# EAGLE schematic CC2533_PCB_Main (EAGLE 6.4)
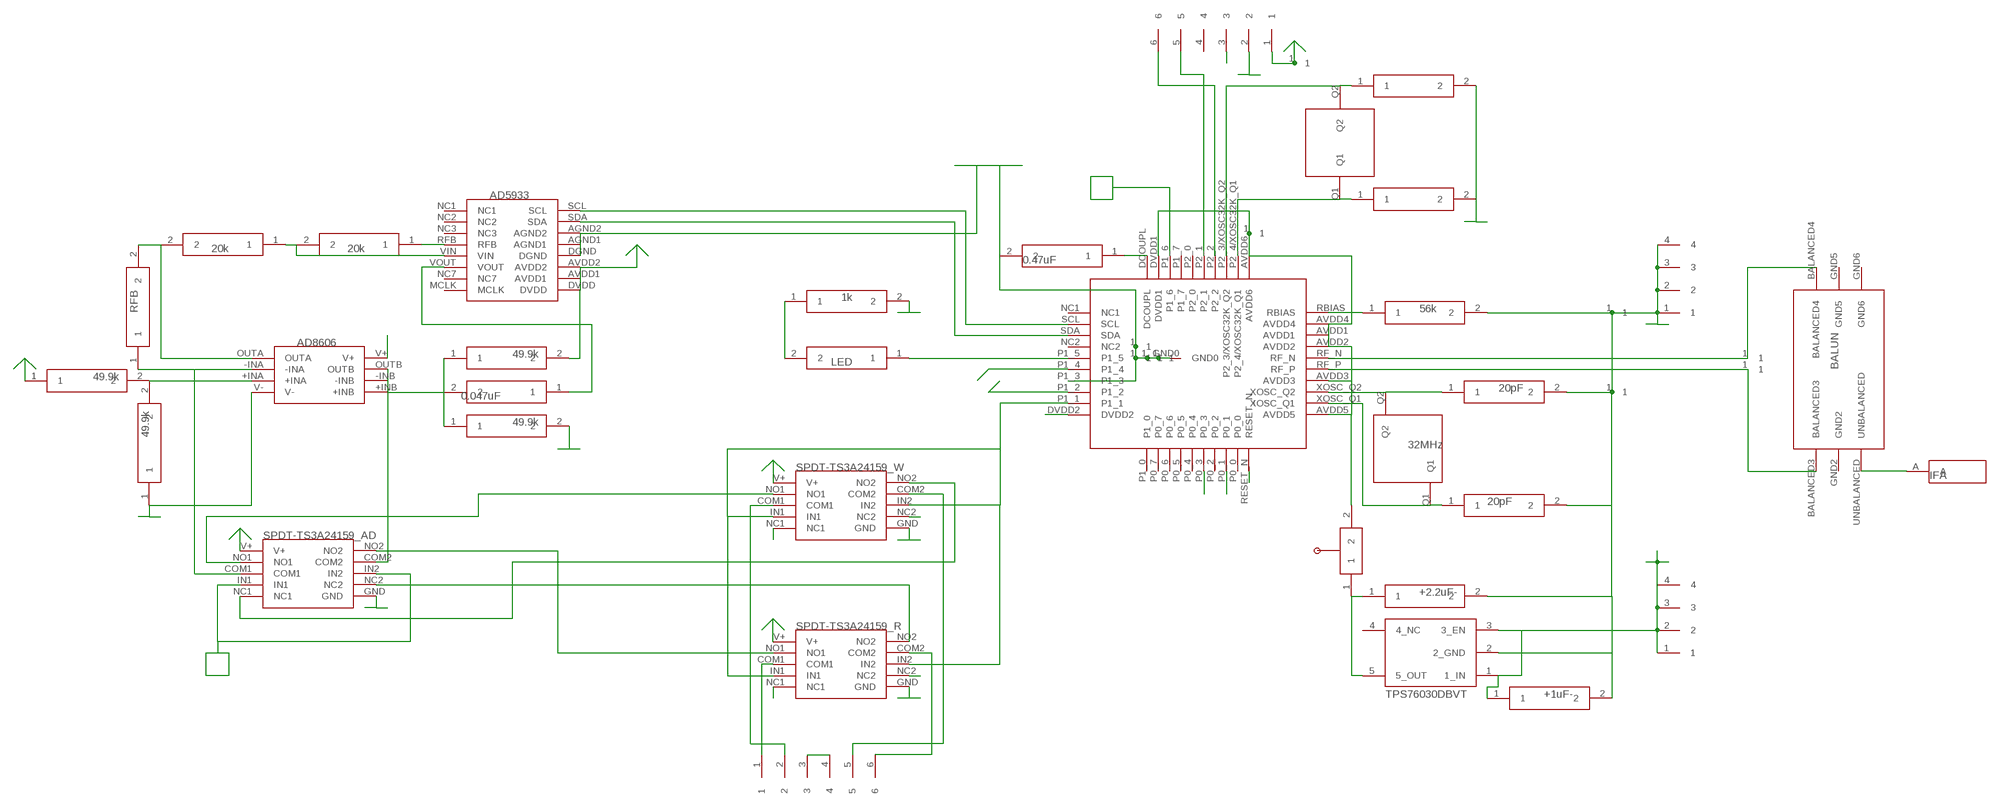
[diagram p0: schematic, sheet 1]

## Parts
U$1  CC2533  [CC2533]
U$2  BALUN  [BALUN]
U$3  X32MHZ  [X32MHZ]
U$4  0201  [0201]
U$5  0201  [0201]
U$6  ANTENNA_BOTTOM  [ANTENNA_BOTTOM]
U$7  FFC4POS  [FFC4POS]
U$8  FFC4POS  [FFC4POS]
U$9  56k  0201  [0201]
U$10  REGULATOR  [REGULATOR]
U$11  0603  [0603]
U$12  0603  [0603]
U$13  SPDT_DUAL  [SPDT_DUAL]
U$14  0201  [0201]
U$15  SPDT_DUAL  [SPDT_DUAL]
U$16  AD5933  [AD5933]
U$17  FFC6POS  [FFC6POS]
U$18  SWITCH_MANUAL  [SWITCH_MANUAL]
U$19  SPDT_DUAL  [SPDT_DUAL]
U$20  AD8606_OPAMP  [AD8606_OPAMP]
U$21  0603_RES  [0603_RES]
U$22  0603_RES  [0603_RES]
U$23  0603_RES  [0603_RES]
U$24  0201  [0201]
U$25  0201  [0201]
U$26  0402_CAP  [0402_CAP]
U$27  0201  [0201]
U$28  0201  [0201]
U$29  0603_RES  [0603_RES]
U$30  FFC6POS  [FFC6POS]
U$31  0402  [0402]
U$32  DRILL_HOLE  [DRILL_HOLE]
U$33  DRILL_HOLE  [DRILL_HOLE]
U$36  DRILL_HOLE  [DRILL_HOLE]
U$39  X32.768KHZ  [X32.768KHZ]
U$40  0201  [0201]
U$41  0201  [0201]
U$42  DRILL_HOLE  [DRILL_HOLE]
U$43  DRILL_HOLE  [DRILL_HOLE]
U$44  DRILL_HOLE  [DRILL_HOLE]
U$45  DRILL_HOLE  [DRILL_HOLE]
U$46  DRILL_HOLE  [DRILL_HOLE]
U$47  DRILL_HOLE  [DRILL_HOLE]
U$48  DRILL_HOLE  [DRILL_HOLE]

## Nets
GND: U$1.GND0 U$1.P1_3 U$4.2 U$5.2 U$8.1 U$8.2 U$8.3 U$8.4 U$9.2 U$10.2(2_GND) U$11.2 U$12.2 U$13.GND U$14.2 U$15.GND U$16.AGND1 U$16.AGND2 U$16.DGND U$17.2 U$19.GND U$20.V- U$25.1 U$28.2 U$30.3 U$30.4 U$31.2 U$40.2 U$41.2 U$42.1 U$43.1 U$44.1 U$45.1 U$46.1 U$47.1
IN1: U$1.P1_1 U$13.IN1 U$13.IN2 U$15.IN1 U$15.IN2
IN2: U$1.P1_6 U$19.IN1 U$19.IN2
LEFT: U$1.P1_4 U$15.NC1
N$1: U$1.RF_N U$2.BALANCED4 U$32.1
N$2: U$1.RF_P U$2.BALANCED3 U$33.1
N$3: U$2.UNBALANCED U$6.A
N$4: U$1.XOSC_Q2 U$3.Q2 U$5.1
N$5: U$1.XOSC_Q1 U$3.Q1 U$4.1
N$6: U$16.RFB U$21.1
N$7: U$15.NO1 U$19.NO1
N$8: U$15.NO2 U$19.NC1
N$9: U$13.COM1 U$30.1
N$10: U$13.COM2 U$30.6
N$11: U$19.COM1 U$20.-INA U$23.1
N$12: U$1.RBIAS U$9.1
N$13: U$1.SCL U$16.SCL
N$14: U$1.SDA U$16.SDA
N$15: U$15.COM1 U$30.2
N$16: U$1.P2_4/XOSC32K_Q1 U$39.Q1 U$41.1
N$17: U$1.P2_1 U$17.5
N$18: U$1.DCOUPL U$14.1
N$19: U$16.VOUT U$26.1
N$20: U$1.P2_2 U$17.6
N$21: U$10.5(5_OUT) U$11.1 U$18.1
N$22: U$1.P2_3/XOSC32K_Q2 U$39.Q2 U$40.1
N$23: U$16.VIN U$21.2 U$22.1
N$24: U$1.P1_5 U$29.1
N$25: U$20.OUTA U$22.2 U$23.2
N$27: U$20.+INA U$24.2 U$25.2
N$28: U$20.+INB U$26.2 U$27.1 U$28.1
N$29: U$19.COM2 U$20.-INB U$20.OUTB
N$30: U$15.COM2 U$30.5
N$31: U$13.NO1 U$19.NO2
N$32: U$13.NO2 U$19.NC2
N$34: U$29.2 U$31.1
P0_1: U$1.P0_1 U$13.NC1
P0_3: U$1.P0_3 U$13.NC2
RESET: U$1.RESET_N U$17.3
RIGHT: U$1.P1_2 U$15.NC2
V+: U$7.1 U$7.2 U$7.3 U$7.4 U$10.1(1_IN) U$10.3(3_EN) U$12.1
VDD: U$1.AVDD1 U$1.AVDD2 U$1.AVDD3 U$1.AVDD4 U$1.AVDD5 U$1.AVDD6 U$1.DVDD1 U$1.DVDD2 U$13.V+ U$15.V+ U$16.AVDD1 U$16.AVDD2 U$16.DVDD U$17.1 U$18.2 U$19.V+ U$20.V+ U$24.1 U$27.2 U$36.1 U$48.1
Unconnected: U$1.P0_0 U$1.P0_2 U$1.P0_4 U$1.P0_5 U$1.P0_6 U$1.P0_7 U$1.P1_0 U$1.P1_7 U$1.P2_0 U$10.4(4_NC) U$16.MCLK U$16.NC1 U$16.NC2 U$16.NC3 U$16.NC7 U$17.4

## Power pins joined to a net without a drawn wire
GND2: U$2.GND2
GND5: U$2.GND5
GND6: U$2.GND6
NC1: U$1.NC1
NC2: U$1.NC2

## Library data of the parts
U$1 = CC2530_PCB_TL:CC2533
U$2 = CC2530_PCB_TL:BALUN: 2.45 GHz Impedance Matched Balun-BPF: For TI CC253X, CC254X, CC257X, CC853X and CC852X Chipset family P/N 2450BM15A0002
U$3 = CC2530_PCB_TL:X32MHZ: X32MHz ABM12-32.000MHZ-B2X-T3; X: 32MHz
U$4 U$5 = CC2530_PCB_TL:0201: Package / Case 0201 (0603 Metric); CAP: 20pF
U$6 = CC2530_PCB_TL:ANTENNA_BOTTOM: Antenna for use in bottom layer of CC2530 PCB
U$7 U$8 = CC2530_PCB_TL:FFC4POS: FFC COnnector 4POS
U$9 = CC2530_PCB_TL:0201: Package / Case 0201 (0603 Metric); R_BIAS: 56k
U$10 = CC2530_PCB_TL:REGULATOR: IC REG LDO 3V 50MA SOT23-5 TPS76030DBVT
U$11 = CC2530_PCB_TL:0603: Package / Case 0603 (1608 Metric); CAP: +2.2uF-
U$12 = CC2530_PCB_TL:0603: Package / Case 0603 (1608 Metric); CAP: +1uF-
U$13 U$15 U$19 = CC2530_PCB_TL:SPDT_DUAL: TS3A24159DGSR IC SWITCH DUAL SPDT 10MSOP
U$14 = CC2530_PCB_TL:0201: Package / Case 0201 (0603 Metric); CAP: 0.47uF
U$16 = CC2530_PCB_TL:AD5933: AD5933
U$17 U$30 = CC2530_PCB_TL:FFC6POS: FFC Connector 6POS
U$18 = CC2530_PCB_TL:SWITCH_MANUAL
U$20 = CC2530_PCB_TL:AD8606_OPAMP: OPAMP AD8606ARMZ-REEL
U$21 U$22 = CC2530_PCB_TL:0603_RES; RES: 20k
U$23 U$29 = CC2530_PCB_TL:0603_RES
U$24 U$25 U$27 U$28 = CC2530_PCB_TL:0201: Package / Case 0201 (0603 Metric); RES: 49.9k
U$26 = CC2530_PCB_TL:0402_CAP; CAP: 0.047uF
U$31 = CC2530_PCB_TL:0402: Package / Case 0402 (1005 Metric); RES: 1k
U$32 U$33 U$36 U$42-U$48 = CC2530_PCB_TL:DRILL_HOLE
U$39 = CC2530_PCB_TL:X32.768KHZ: X32.768kHz 9HT11-32.768KDZC-T
U$40 U$41 = CC2530_PCB_TL:0201: Package / Case 0201 (0603 Metric)